# Altium schematic sheet peripheral.SchDoc
size C
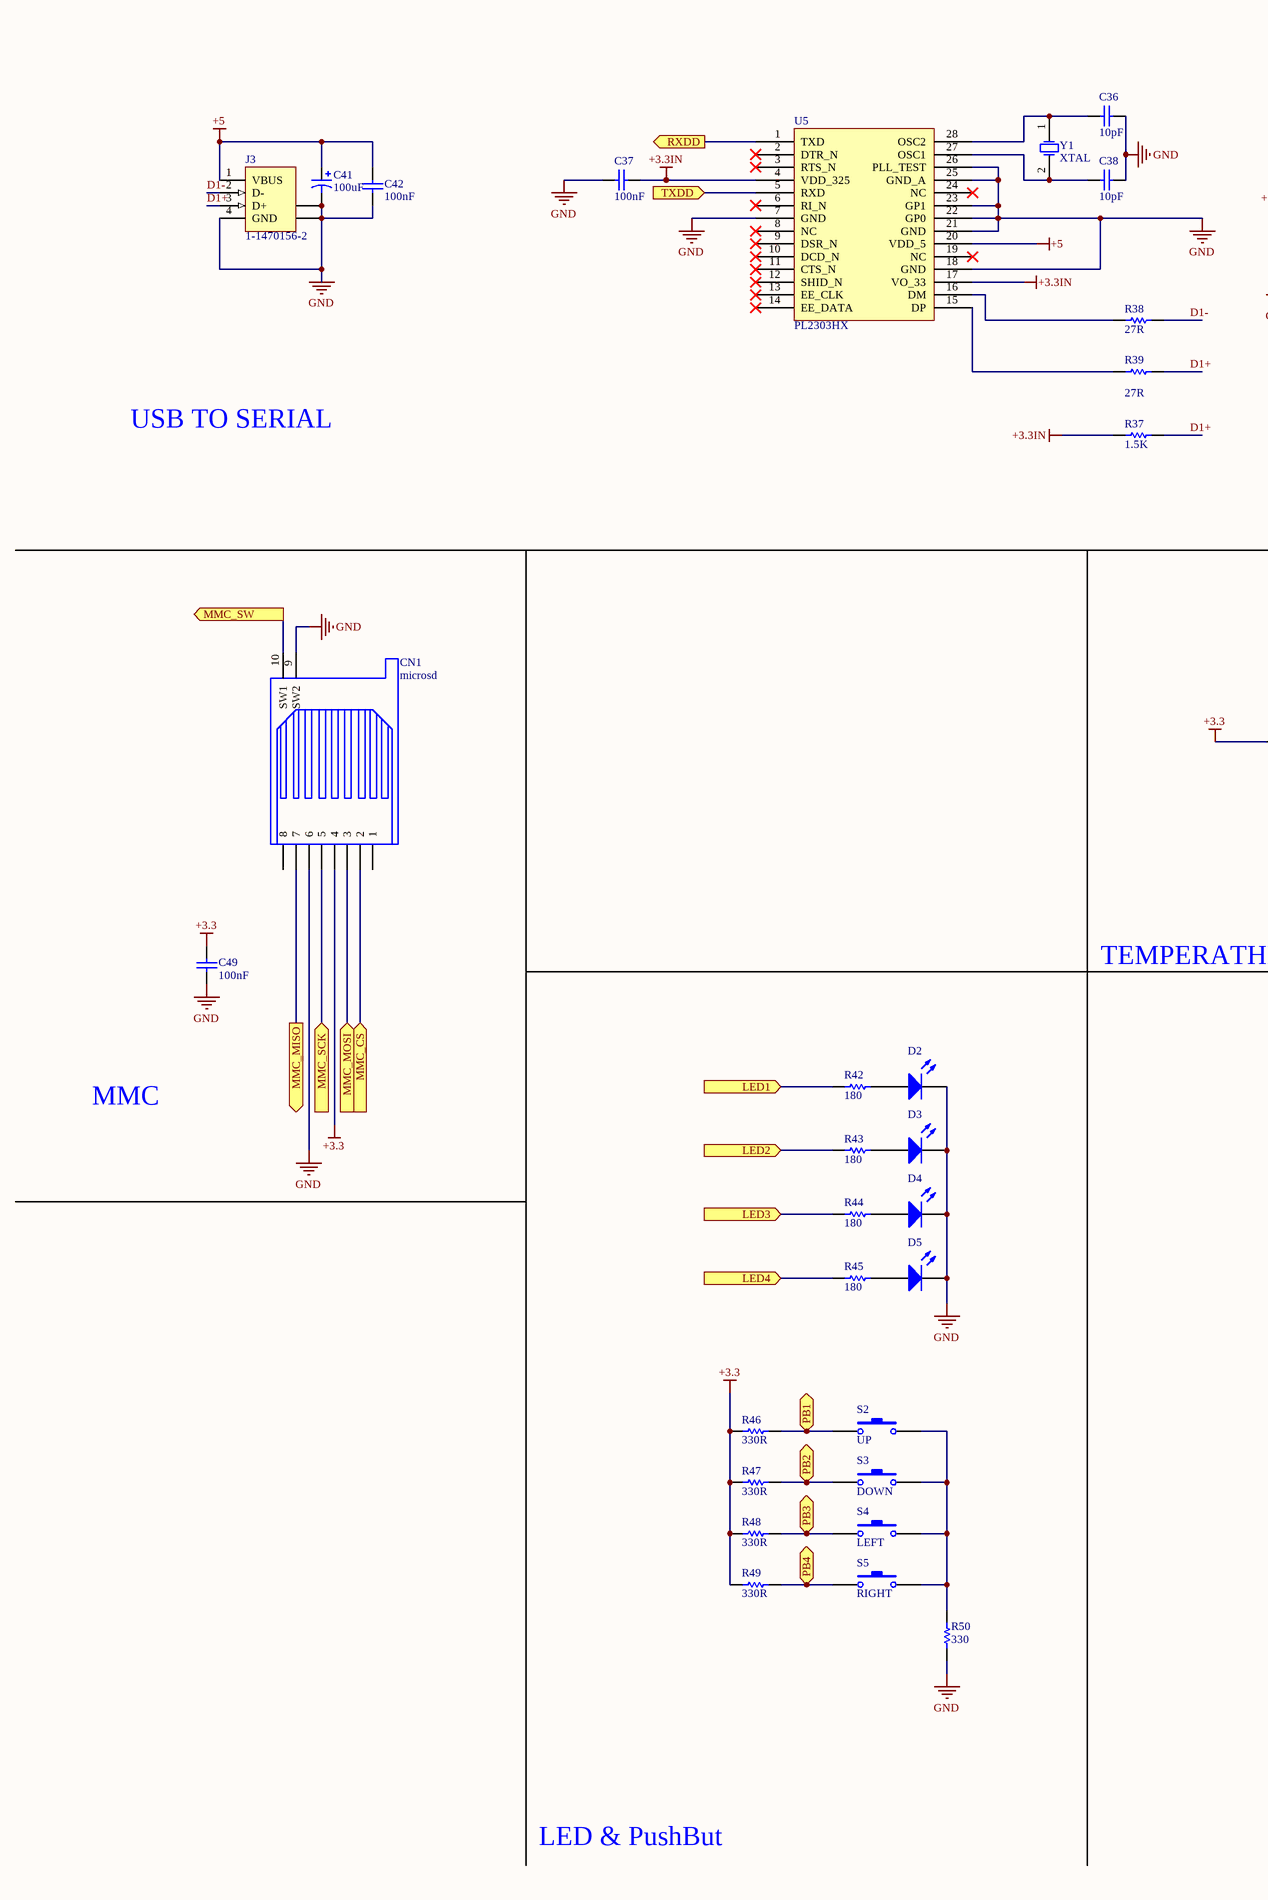
[diagram p0: peripheral.SchDoc, left]
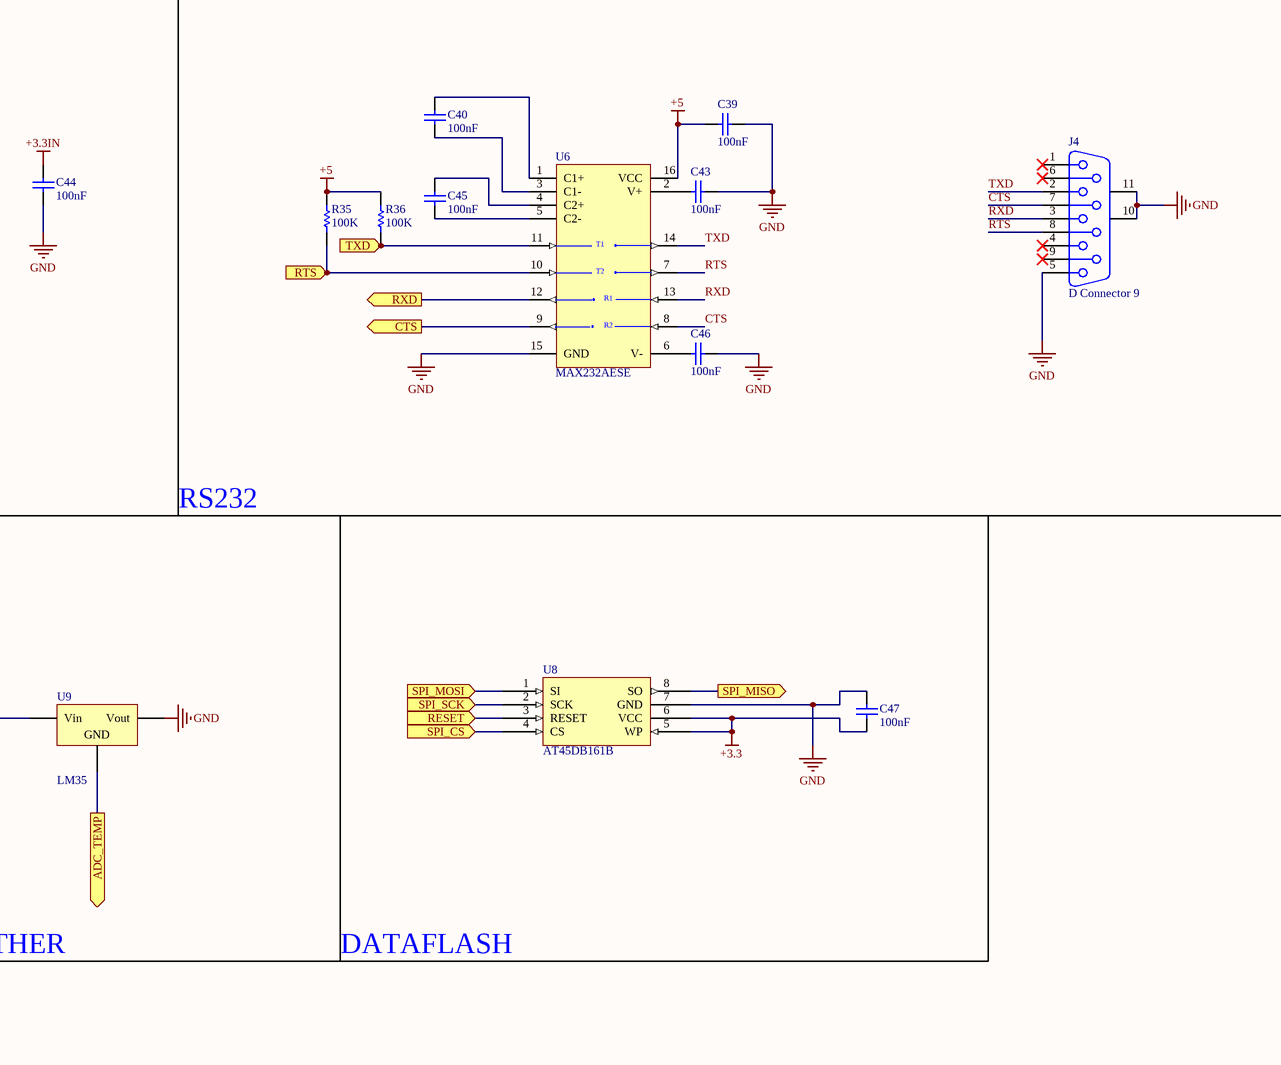
[diagram p1: peripheral.SchDoc, right]

## Parts
C36  10pF  [1206]
C37  100nF  [1206]
C38  10pF  [1206]
C39  100nF  [1206]
C40  100nF  [1206]
C41  100uF  [CAP470]
C42  100nF  [1206]
C43  100nF  [1206]
C44  100nF  [1206]
C45  100nF  [1206]
C46  100nF  [1206]
C47  100nF  [1206]
C49  100nF  [1206]
CN1  microsd  [MicroSD_1]
D2  LED3  [LED-1206]  (value not drawn)
D3  LED3  [LED-1206]  (value not drawn)
D4  LED3  [LED-1206]  (value not drawn)
D5  LED3  [LED-1206]  (value not drawn)
J3  1-1470156-2  [440247]
J4  D Connector 9  [DSUB1.385-2H9]
R35  100K  [1206]
R36  100K  [1206]
R37  1.5k  [1206]
R38  value 27R  [1206]  (hidden comment: 27)
R39  value 27R  [1206]  (hidden comment: 27)
R42  180  [1206]
R43  180  [1206]
R44  180  [1206]
R45  180  [1206]
R46  330R  [1206]
R47  330R  [1206]
R48  330R  [1206]
R49  330R  [1206]
R50  330  [1206]
S2  UP  [SWSMD]
S3  DOWN  [SWSMD]
S4  LEFT  [SWSMD]
S5  RIGHT  [SWSMD]
U5  PL2303HX  [SSOP-SS28_M]
U6  MAX232AESE  [NSO16_N]
U8  AT45DB161B  [SOP8]
U9  LM35  [to-92]
Y1  XTAL  [XTAL3]

## Ports
ADC_TEMP (out), CTS (out), LED1 (in), LED2 (in), LED3 (in), LED4 (in), MMC_CS (in), MMC_MISO (out), MMC_MOSI (in), MMC_SCK (in), MMC_SW (out), PB1 (out), PB2 (out), PB3 (out), PB4 (out), RESET (in), RTS (in), RXD (out), RXDD (out), SPI_CS (in), SPI_MISO (out), SPI_MOSI (in), SPI_SCK (in), TXD (in), TXDD (in)

## Nets
+3.3: C47.1 C49.2 CN1.4 R46.2 R47.2 R48.2 R49.2 U8.5(WP) U8.6(VCC) U9.1(Vin)
+3.3IN: C37.2 C44.2 R37.2 U5.4(VDD_325) U5.17(VO_33)
+5: C39.2 C41.1 C42.2 J3.1(VBUS) R35.1 R36.1 U5.20(VDD_5) U6.16(VCC)
GND: C36.1 C37.1 C38.1 C39.1 C41.2 C42.1 C43.1 C44.1 C46.1 C47.2 C49.1 CN1.6 CN1.9(SW2) D2.2(K) D3.2(K) D4.2(K) D5.2(K) J3.4(GND) J3.5(SHLD) J3.6(SHLD) J4.5 J4.10(MH1) J4.11(MH2) R50.1 U5.7(GND) U5.18(GND) U5.21(GND) U5.22(GP0) U5.23(GP1) U5.25(GND_A) U5.26(PLL_TEST) U6.15(GND) U8.7(GND) U9.3(Vout)
ADC_TEMP: U9.2(GND) ; port ADC_TEMP
CTS: J4.7 U6.8(R2IN)
CTS: U6.9(R2OUT) ; port CTS  [a separate net that carries the same name]
D1+: J3.3(D+) R37.1 R39.2
D1-: J3.2(D-) R38.1
LED1: R42.1 ; port LED1
LED2: R43.1 ; port LED2
LED3: R44.1 ; port LED3
LED4: R45.1 ; port LED4
MMC_CS: CN1.2 ; port MMC_CS
MMC_MISO: CN1.7 ; port MMC_MISO
MMC_MOSI: CN1.3 ; port MMC_MOSI
MMC_SCK: CN1.5 ; port MMC_SCK
MMC_SW: CN1.10(SW1) ; port MMC_SW
PB1: R46.1 S2.1 ; port PB1
PB2: R47.1 S3.1 ; port PB2
PB3: R48.1 S4.1 ; port PB3
PB4: R49.1 S5.1 ; port PB4
RESET: U8.3(RESET) ; port RESET
RTS: R35.2 U6.10(T2IN) ; port RTS
RTS: J4.8 U6.7(T2OUT)  [a separate net that carries the same name]
RXD: J4.3 U6.13(R1IN)
RXD: U6.12(R1OUT) ; port RXD  [a separate net that carries the same name]
RXDD: U5.1(TXD) ; port RXDD
SPI_CS: U8.4(CS) ; port SPI_CS
SPI_MISO: U8.8(SO) ; port SPI_MISO
SPI_MOSI: U8.1(SI) ; port SPI_MOSI
SPI_SCK: U8.2(SCK) ; port SPI_SCK
TXD: R36.2 U6.11(T1IN) ; port TXD
TXD: J4.2 U6.14(T1OUT)  [a separate net that carries the same name]
TXDD: U5.5(RXD) ; port TXDD
NetC36_2: C36.2 U5.28(OSC2) Y1.1(OSC1)
NetC38_2: C38.2 U5.27(OSC1) Y1.2(OSC2)
NetC40_1: C40.1 U6.3(C1-)
NetC40_2: C40.2 U6.1(C1+)
NetC43_2: C43.2 U6.2(V+)
NetC45_1: C45.1 U6.5(C2-)
NetC45_2: C45.2 U6.4(C2+)
NetC46_2: C46.2 U6.6(V-)
NetD2_1: D2.1(A) R42.2
NetD3_1: D3.1(A) R43.2
NetD4_1: D4.1(A) R44.2
NetD5_1: D5.1(A) R45.2
NetR38_2: R38.2 U5.16(DM)
NetR39_1: R39.1 U5.15(DP)
NetR50_2: R50.2 S2.2 S3.2 S4.2 S5.2

Not connected (* = marked no-connect by the designer): CN1 1 8; J4 1* 4* 6* 9*; U5 2(DTR_N)* 3(RTS_N)* 6(RI_N)* 8(NC)* 9(DSR_N)* 10(DCD_N)* 11(CTS_N)* 12(SHID_N)* 13(EE_CLK)* 14(EE_DATA)* 19(NC)* 24(NC)*

## Notes on the sheet
- USB TO SERIAL
- RS232
- TEMPERATHER
- DATAFLASH
- MMC
- LED & PushBut
- (in symbol MAX232AESE) T1; T2; R1; R2

## Library data of the parts
C36-C40 C42-C47 C49 = Cap: Capacitor; Value: 100pF; Published: 8-Jun-2000; LatestRevisionDate: 17-Jul-2002; LatestRevisionNote: Re-released for DXP Platform.; PackageReference: RAD-0.3; Publisher: Altium Limited; PackageDescription: Radial Cap, Thru-Hole; 2 Leads; 0.3 in Pin Spacing
C41 = Cap Pol1: Polarized Capacitor (Radial); Published: 8-Jun-2000; LatestRevisionDate: 17-Jul-2002; LatestRevisionNote: Re-released for DXP Platform.; PackageReference: RB7.6-15; Publisher: Altium Limited; PackageDescription: Polarized Capacitor (Radial); 2 Leads; Value: 100uF
CN1 = SMS016AFA5E
D2-D5 = LED3: Typical BLUE SiC LED; Published: 8-Jun-2000; LatestRevisionDate: 17-Dec-2003; LatestRevisionNote: PCB Footprint replaced.; DatasheetVersion: 16-Apr-2002; PackageVersion: 16-Apr-2002; PackageReference: 3.5X2.8X1.9; Publisher: Altium Limited
J3 = 1-1470156-2: USB 1.1, Right Angle, Thru-Hole, B Type, Receptacle, 4 Position, Black; ContactMaterial: Phosphor Bronze; ContactPlating: Gold over Nickel; TerminationLength: 3.00mm [0.118in.]; PCB_Layout: Complies with manufacturer's recommendation.; DrillSize: Corresponds to nominal value.; PanelGround: Without; Published: 15-Jul-2004; DatasheetDocument: 02-Jun-2001; PackageDocument: 02-Jun-2001; PackageReference: 1-1470156; Publisher: Altium Limited; HousingMaterial: Glass-Filled Thermoplastic; ComponentLink1Description: Manufacturer Link; ComponentLink1URL: http://www.tycoelectronics.com/; ComponentLink2Description: Packaging Specification; ComponentLink2URL: http://ecommas.tycoelectronics.com/commerce/DocumentDelivery/DDEController?Action=showdoc&DocId=Customer+Drawing%7F1470156%7FO%7Ftif%7FEnglish%7FC_1470156_O.tif
J4 = D Connector 9: Receptacle Assembly, 9 Position, Right Angle; PackageDocument: O; Positions: 9; Published: 15-Jun-2001; LatestRevisionDate: 17-Jul-2002; LatestRevisionNote: Re-released for DXP Platform.; DatasheetDocument: 1-Sep-1999; PackageReference: 788750; Publisher: Altium Limited; Orientation: Right Angle; Gender: Receptacle
R35 R36 = Res1: Resistor; Value: 1K; Published: 8-Jun-2000; Revision: July-2002: Re-released for DXP Platform.; Publisher: Altium Limited
R37-R39 = Res1: Resistor; Published: 8-Jun-2000; LatestRevisionDate: 17-Jul-2002; LatestRevisionNote: Re-released for DXP Platform.; PackageReference: AXIAL-0.3; Publisher: Altium Limited
  R37: Value: 1.5K
R42-R50 = Res Semi: Semiconductor Resistor; Value: 27; Published: 8-Jun-2000; LatestRevisionDate: 17-Jul-2002; LatestRevisionNote: Re-released for DXP Platform.; PackageReference: AXIAL-0.5; Publisher: Altium Limited
S2-S5 = SW-PB: Switch; Published: 24-Mar-1999; LatestRevisionDate: 17-Jul-2002; LatestRevisionNote: Re-released for DXP Platform.; PackageReference: SPST-2; Publisher: Altium Limited
U5 = PL2303
U6 = MAX232AESE: +5V-Powered, Multichannel RS-232 Driver/Receiver; Published: 16-Jan-2001; LatestRevisionDate: 13-Apr-2006; LatestRevisionNote: IPC-7351 Footprint Added.; DatasheetVersion: Nov-1997; PackageReference: NSO16; Publisher: Altium Limited; PackageDescription: 16-Pin Small Outline Integrated Circuit 1.27 mm Pitch; Code_JEDEC: MS-012-AC; Code_IPC: SOIC127P600-16; ComponentLink1Description: Manufacturer Link; ComponentLink1URL: http://www.maxim-ic.com/; ComponentLink2Description: Datasheet; ComponentLink2URL: http://pdfserv.maxim-ic.com/en/ds/MAX220-MAX249.pdf
U9 = Volt Reg: Voltage Regulator; Published: 24-Mar-1999; LatestRevisionDate: 29-May-2009; LatestRevisionNote: IPC-7351 Footprint Added.; PackageReference: D2PAK; Publisher: Altium Limited; PackageDescription: 3-Pin Transistor Outline Package 2.54 mm Pitch, 15.1 mm Lead Span
Y1 = XTAL: Crystal Oscillator; Published: 8-Jun-2000; LatestRevisionDate: 17-Jul-2002; LatestRevisionNote: Re-released for DXP Platform.; PackageReference: R38; Publisher: Altium Limited; PackageDescription: Crystal, Thru-Hole; 2 Leads; Body 3.1 x 8.2 mm (Dia.xH)